# EAGLE design Inline DC Panel Meter (EAGLE 9.6.2)
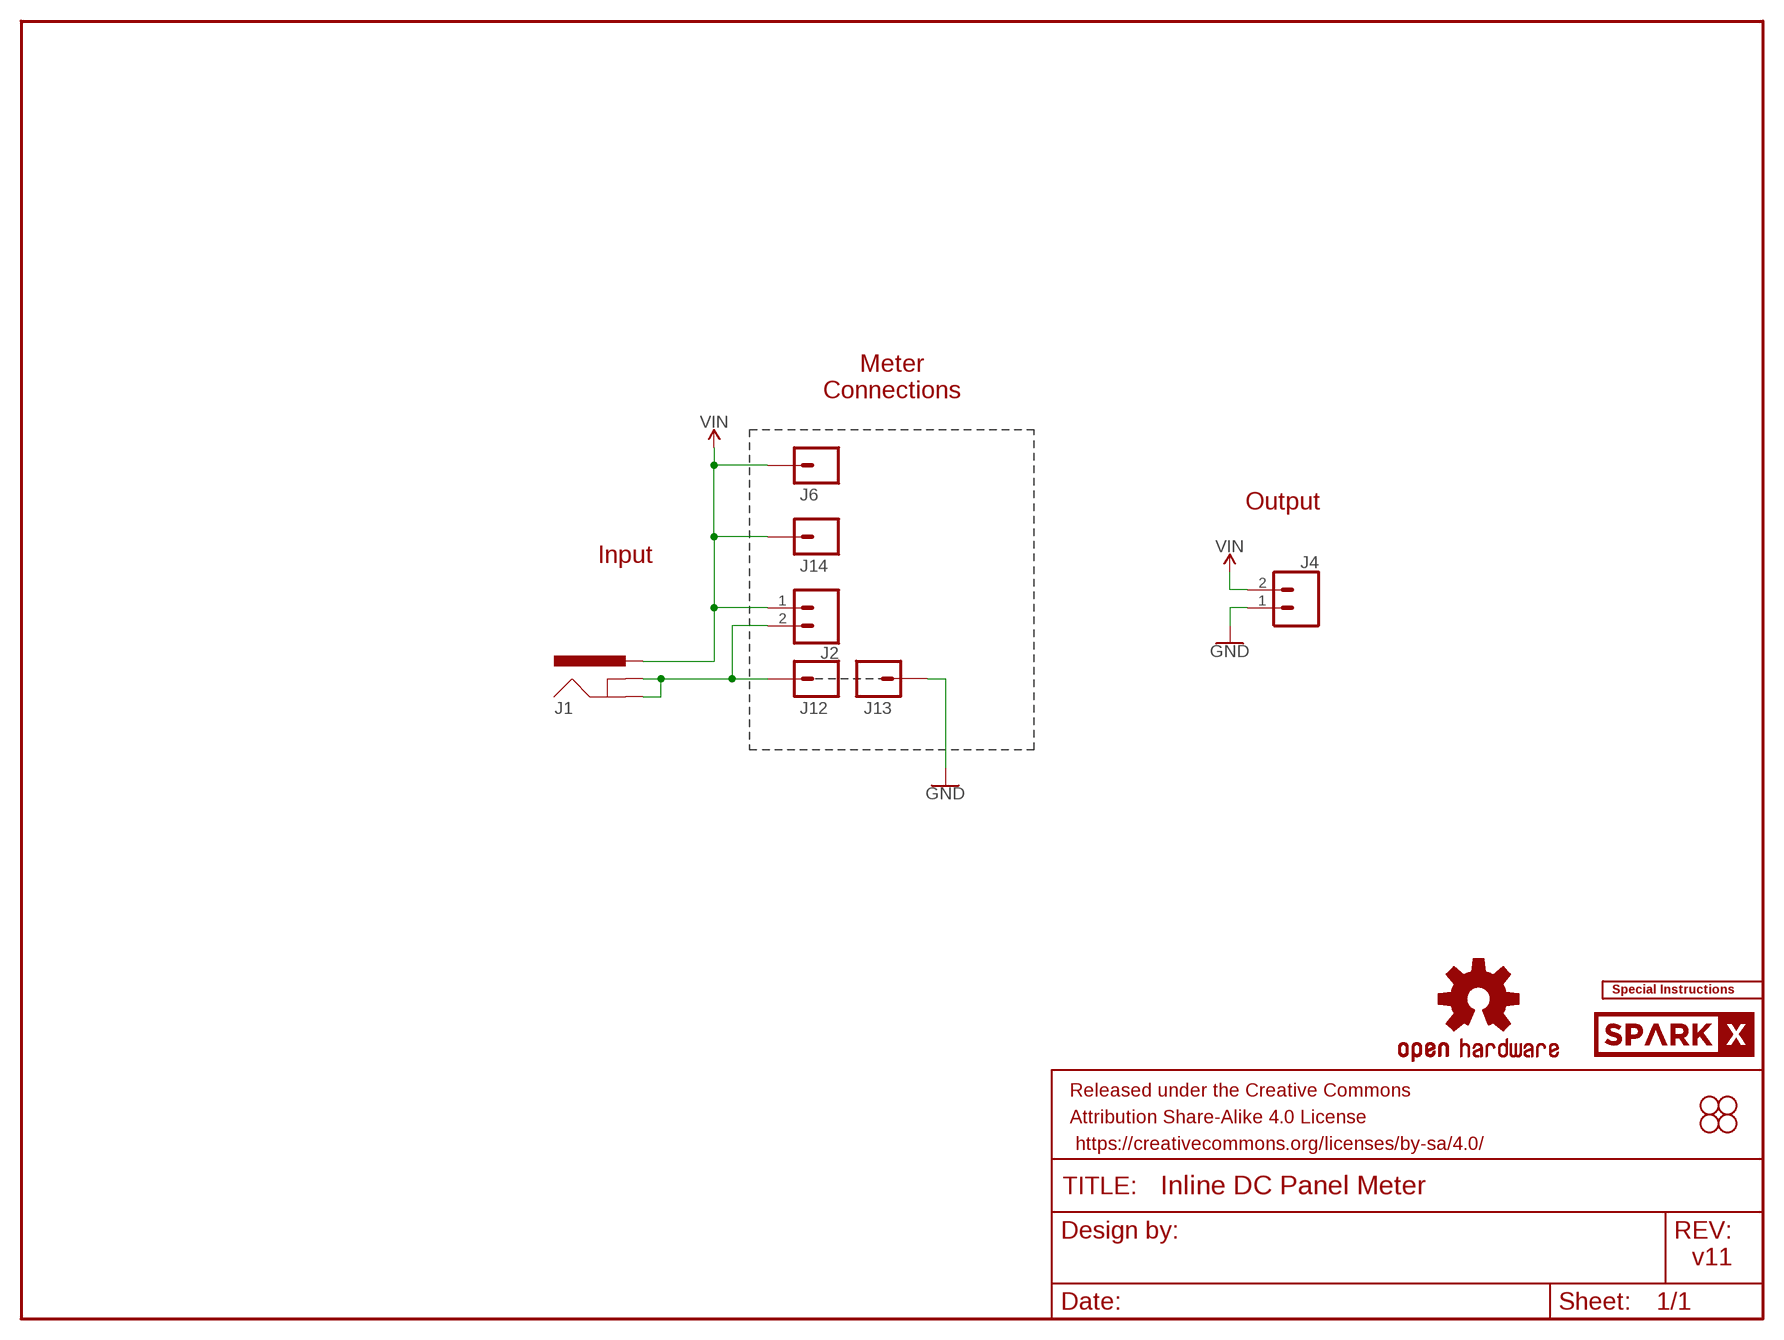
[diagram p0: schematic, sheet 1]

## Parts
FRAME2  FRAME-LETTER  [CREATIVE_COMMONS]
H1  STAND-OFF  [STAND-OFF]
H2  STAND-OFF  [STAND-OFF]
H3  STAND-OFF  [STAND-OFF]
H4  STAND-OFF  [STAND-OFF]
J1  POWER_JACKPOWER_JACK_SLOT  [POWER_JACK_PTH_SLOT]
J2  CONN_025MM  [SCREWTERMINAL-5MM-2]
J4  CONN_025MM  [SCREWTERMINAL-5MM-2]
J6  CONN_01PTH_NO_SILK_YES_STOP  [1X01_NO_SILK]
J12  CONN_01PTH_2MM  [1X01_2MM]
J13  CONN_01PTH_2MM  [1X01_2MM]
J14  CONN_01PTH_NO_SILK_YES_STOP  [1X01_NO_SILK]
LOGO1  OSHW-LOGOS  [OSHW-LOGO-S]
LOGO3  SPECIAL_INSTRUCTIONS-ORDERING  [ORDERING_INSTRUCTIONS]
U$1  SPARKX-LOGO5  [SPARKX-LARGE]

## Nets
GND [power]: J4.1 J13.1
GND_RETURN: J1.GND J1.GNDBREAK J2.2 J12.1
VIN: J1.PWR J2.1 J4.2 J6.1 J14.1

## Notes on the sheet
- Meter
  Connections
- Output
- Input
- v11

## Library data of the parts
FRAME2 = SparkFun-Aesthetics:FRAME-LETTER: Schematic Frame - Letter Standard 8.5x11 US Letter frame
H1-H4 = SparkFun-Hardware:STAND-OFF: Stand Off Drill holes for mechanically mounting via screws, standoffs, etc. Note: Use the keepout ring to avoid running the screw head into surrounding components. Variant Overviews STAND-OFF - Mechanical footprint for a #4 phillips button head screw. STAND-OFF-TIGHT - Mechanical footprint for a #4 phillips button head screw, Example SparkFun Products Screw - Phillips Head (1/4", 4-40, 10 pack) <https://www.sparkfun.com/products/10453> (PRT-10453) Screw - Phillips Head (1/2", 4-40, 10 pack) <https://www.sparkfun.com/products/10452> (PRT-10452) Screw - Phillips Head (3/4", 4-40, 10 pack) <https://www.sparkfun.com/products/10451> (PRT-10451) Screw - Phillips Head (1", 4-40, 10 pack) <https://www.sparkfun.com/products/10450> (PRT-10450)
J1 = SparkFun-Connectors:POWER_JACK: Power Jack Connector This is the standard 5.5mm barrel jack for power. The PTH is the most common, proven, reliable, footprint. The Slot footprint only works if the mill layer is transmitted to the PCB fab house so be warned. Here are the connectors we sell at SparkFun: DC Barrel Power Jack/Connector <https://www.sparkfun.com/products/119> (PRT-00119) DC Barrel Power Jack/Connector (SMD) <https://www.sparkfun.com/products/12748> (PRT-12748) DC Barrel Jack Adapter - Breadboard Compatible <https://www.sparkfun.com/products/10811> (PRT-10811) It is used on this SparkFun product (and many, many others): SparkFun RedBoard - Programmed with Arduino <https://www.sparkfun.com/products/12757> (DEV-12757) Also, if you need a mating power supply or connector, please check these out: Wall Adapter Power Supply - 9VDC 650mA <https://www.sparkfun.com/products/298> (TOL-00298) DC Barrel Jack Adapter - Male <https://www.sparkfun.com/products/10287> (PRT-10287); PROD_ID: CONN-08197
J2 J4 = SparkFun-Connectors:CONN_02: Multi connection point. Often used as Generic Header-pin footprint for 0.1 inch spaced/style header connections On any of the 0.1 inch spaced packages, you can populate with these: Break Away Headers - Straight <https://www.sparkfun.com/products/116> (PRT-00116) Break Away Male Headers - Right Angle <https://www.sparkfun.com/products/553> (PRT-00553) Female Headers <https://www.sparkfun.com/products/115> (PRT-00115) Break Away Headers - Machine Pin <https://www.sparkfun.com/products/117> (PRT-00117) Break Away Female Headers - Swiss Machine Pin <https://www.sparkfun.com/products/743> (PRT-00743) For SCREWTERMINALS and SPRING TERMINALS visit here: Screw Terimnals on SparkFun.com <https://www.sparkfun.com/search/results?term=Screw+Terminals> (5mm/3.5mm/2.54mm spacing) This device is also useful as a general connection point to wire up your design to another part of your project. Our various solder wires solder well into these plated through hole pads. Hook-Up Wire - Assortment (Stranded, 22 AWG) <https://www.sparkfun.com/products/11375> (PRT-11375) Hook-Up Wire - Assortment (Solid Core, 22 AWG) <https://www.sparkfun.com/products/11367> (PRT-11367) View the entire wire category on our website here <https://www.sparkfun.com/categories/141> Special notes: Molex polarized connector foot print use with: PRT-08233 with associated crimp pins and housings. 2.54_SCREWTERM for use with PRT-10571. 3.5mm Screw Terminal footprints for PRT-08084 5mm Screw Terminal footprints for use with PRT-08432; SF_SKU: PRT-08432
J6 J12-J14 = SparkFun-Connectors:CONN_01: Single connection point. Often used as Generic Header-pin footprint for 0.1 inch spaced/style header connections On any of the 0.1 inch spaced packages, you can populate with these: Break Away Headers - Straight <https://www.sparkfun.com/products/116> (PRT-00116) Break Away Male Headers - Right Angle <https://www.sparkfun.com/products/553> (PRT-00553) Female Headers <https://www.sparkfun.com/products/115> (PRT-00115) Break Away Headers - Machine Pin <https://www.sparkfun.com/products/117> (PRT-00117) Break Away Female Headers - Swiss Machine Pin <https://www.sparkfun.com/products/743> (PRT-00743) This device is also useful as a general connection point to wire up your design to another part of your project. Our various solder wires solder well into these plated through hole pads. Hook-Up Wire - Assortment (Stranded, 22 AWG) <https://www.sparkfun.com/products/11375> (PRT-11375) Hook-Up Wire - Assortment (Solid Core, 22 AWG) <https://www.sparkfun.com/products/11367> (PRT-11367) View the entire wire category on our website here <https://www.sparkfun.com/categories/141> Special notes: SMTSO-256-ET is a "flush mount" nut for a 4-40 screw. We mostly use this on specialty testbeds; it is a nice way to connect hardware to your PCB at an adjustable hieght. Also note, the SNAP packages are for using a snappable style connector. We sell a baggie of snaps and they are also used on two LilyPad designs: Snap Assortment - 30 pack (male and female) <https://www.sparkfun.com/products/11347> (DEV-11347) LilyPad Arduino SimpleSnap <https://www.sparkfun.com/products/10941> (DEV-10941) LilyPad SimpleSnap Protoboard <https://www.sparkfun.com/products/10940> (DEV-10940)
LOGO1 = SparkFun-Aesthetics:OSHW-LOGO: Open-Source Hardware (OSHW) Logo This logo indicates the piece of hardware it is found on incorporates a OSHW license and/or adheres to the definition of open source hardware found here: http://freedomdefined.org/OSHW
LOGO3 = SparkFun-Aesthetics:SPECIAL_INSTRUCTIONS: Special Ordering/Production Instructions Alert Symbol for special PCB ordering instructions or unique production process warnings. Ordering Instructions Production Instructions Types of information that should be added to box: Copper weight Soldermask color Silk color PCB thickness Number of layers PCB Standard: 1.6mm FR4 1 oz copper immersion silver plating red soldermask white silkscreen Types of information that should be added to box: Special wash requirements Depaneling instructions Humidification Glue curing Default text settings: 0.07 inch 9% ratio 50% line distance
U$1 = SparkX:SPARKX-LOGO

## Net classes
1 power: width 0.254 mm

## Board
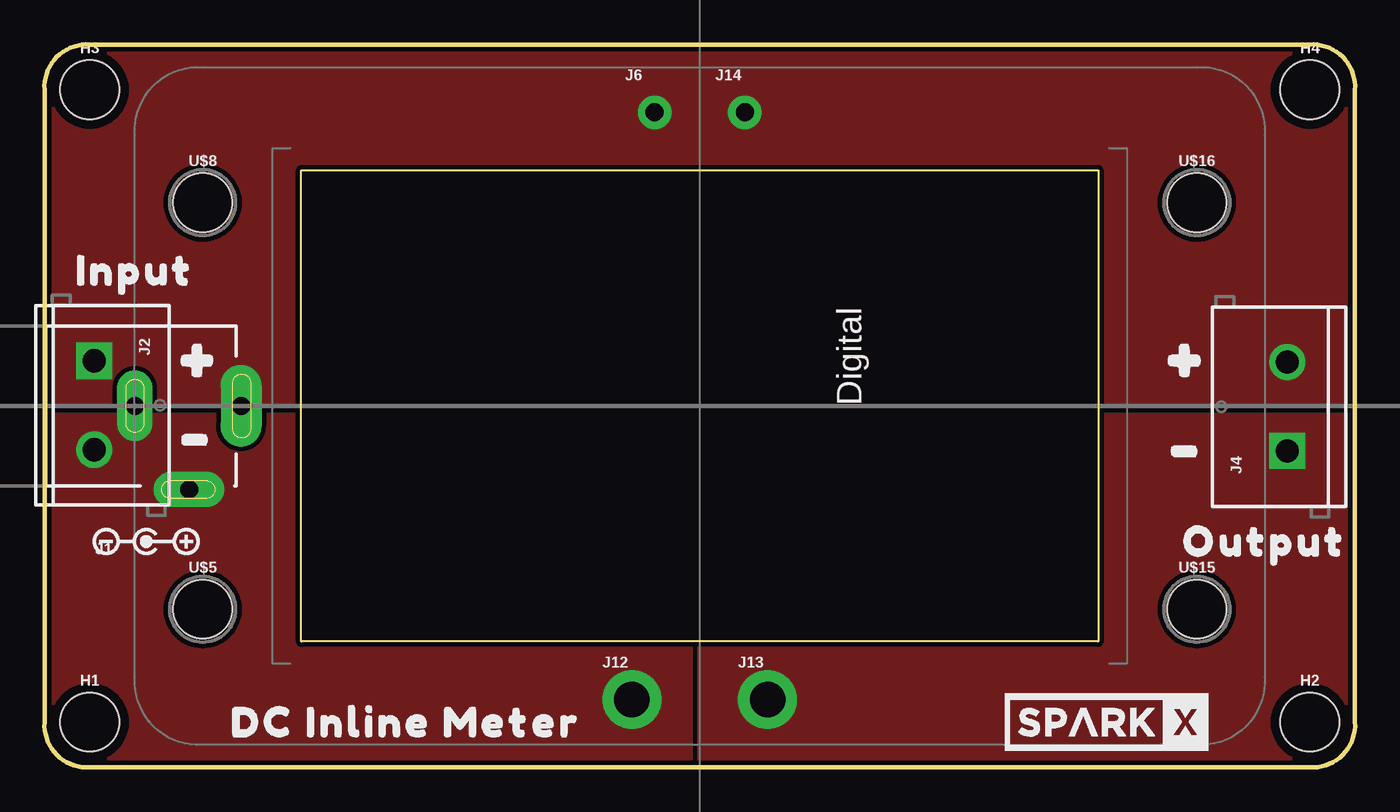
[diagram p1: board, top side]
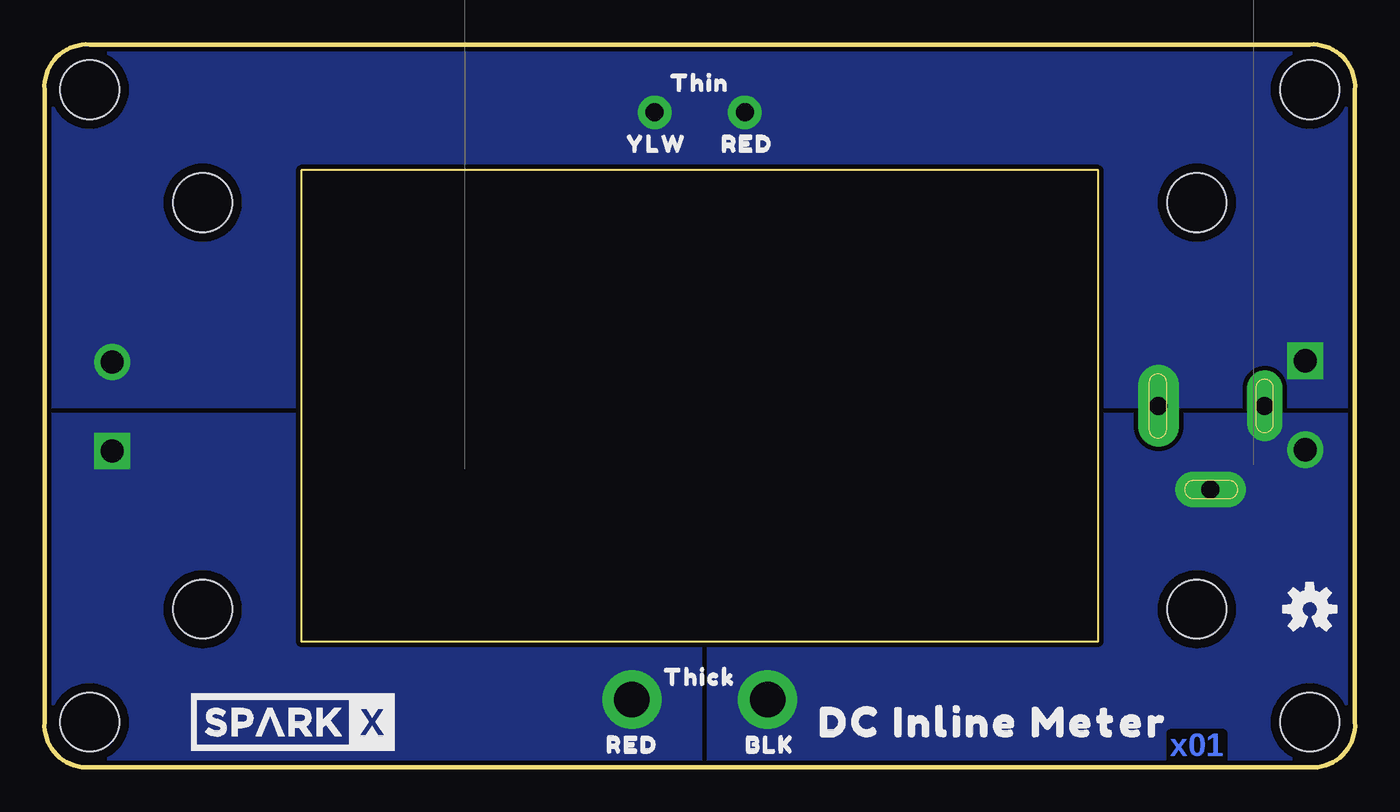
[diagram p2: board, bottom side, seen from below]

Size 73.67 x 40.65 mm. Coordinates in mm from the lower left corner, seen from the top.
Outline: 0,2.54 0,38.1 arc-97 2.54,40.64 71.12,40.64 arc-97 73.66,38.1 73.66,2.54 arc-97 71.12,0 2.54,0 arc-97 0,2.54
Copper layers (1*16): Top 0.035mm / dielectric 1.5mm / Bottom 0.035mm
Design rules "SparkFun-2-Layer-General-JLCPCB": minimum track width 7mil, minimum drill 0.3mm, track to track 7mil, track to pad 7mil, pad to pad 7mil, via to via 7mil, smd to smd 7mil, copper to edge 7mil, drill to drill 7mil, minimum pad ring 7mil, minimum via ring 7mil, stop-mask expansion 3mil, vias tented up to drill 25mil, thermal gap 10mil

### Footprints (pad centres in the part's own frame; a part is rotated, then mirrored left to right if it is on the bottom)
STAND-OFF = hole 3.302: 0,0
POWER_JACK_PTH_SLOT = drill 1 pad 2 long: GND 0,0; GNDBREAK -3.048,4.699 | drill 1 pad 2.3 long: PWR -5.969,0
SCREWTERMINAL-5MM-2 = drill 1.3 pad 2.032 square: 1 0,0 | drill 1.3 pad 2.032: 2 5,0
1X01_NO_SILK = drill 1.016 pad 1.88: 1 0,0
1X01_2MM = drill 2 pad 3.302: 1 0,0

### Placement (x,y rotation side)
FRAME2  0,-21.59 0 top  (outside the outline)
H1  2.54,2.54 0 top
H2  71.12,2.54 0 top
H3  2.54,38.1 0 top
H4  71.12,38.1 0 top
J1  5.08,20.32 180 top
J2  2.8,22.86 270 top
J4  69.85,17.78 90 top
J6  34.29,36.83 0 top
J12  33.02,3.81 0 top
J13  40.64,3.81 0 top
J14  39.37,36.83 0 top
LOGO1  2.54,8.89 0 bottom
LOGO3  109.49,51.82 0 top  (outside the outline)
U$1  59.69,2.54 0 top
U$2  [DC_INLINE_METER0]  20.32,2.54 0 bottom
U$3  [INPUT0]  5.08,27.94 0 top
U$4  [POLARITY_MARKING_CENTER_POSITIVE#JPG]  5.72,12.7 0 top
U$5  [STAND-OFF]  8.89,8.89 0 top
U$7  [OUTPUT1]  68.58,12.7 0 top
U$8  [STAND-OFF]  8.89,31.75 0 top
U$9  [DC_INLINE_METER0]  20.32,2.54 0 top
U$10  [#0]  64.27,22.86 0 top
U$11  [#1]  64.27,17.78 0 top
U$12  [THIN0]  36.83,38.48 0 bottom
U$13  [#0]  8.77,22.86 0 top
U$14  [#1]  8.64,18.42 0 top
U$15  [STAND-OFF]  64.77,8.89 0 top
U$16  [STAND-OFF]  64.77,31.75 0 top
U$17  [METER]  36.83,20.32 0 top
U$21  SPARKX-LOGO5  [SPARKX-LARGE]  59.69,2.54 0 bottom
U$31  [BLK1]  32.9,1.27 0 bottom
U$32  [RED0]  34.17,35.06 0 bottom
U$33  [YLW2]  39.25,35.06 0 bottom
U$35  [RED0]  40.64,1.27 0 bottom
U$43  [THICK0]  36.83,5.08 0 bottom

### Tracks (layer width: path | path; a pad name or v marks a point on that pad's centre or on a via)
GND
  pour Bottom (isolate 0.254, rank 2, no thermals): 36.83,20.32 73.66,20.32 73.66,0 36.83,0
  pour Top (isolate 0.254, rank 2, no thermals): 73.66,20.32 36.83,20.32 36.83,0 73.66,0
GND_RETURN
  pour Top (isolate 0.254, rank 3, no thermals): 36.83,20.32 0,20.32 0,0 36.83,0
  pour Bottom (isolate 0.254, rank 3, no thermals): 0,20.32 36.83,20.32 36.83,0 0,0
VIN
  pour Top (isolate 0.254, no thermals): 0,40.64 73.66,40.64 73.66,20.32 0,20.32
  pour Bottom (isolate 0.254, no thermals): 73.66,40.64 0,40.64 0,20.32 73.66,20.32

### Text on the board
Bottom: x01
tNames: Digital
tDocu: 1 oz copper